# Altium schematic sheet STM32_ nRF24GHz.SchDoc
size 250 x 199 mm; SheetNumber: 2; SheetTotal: 2
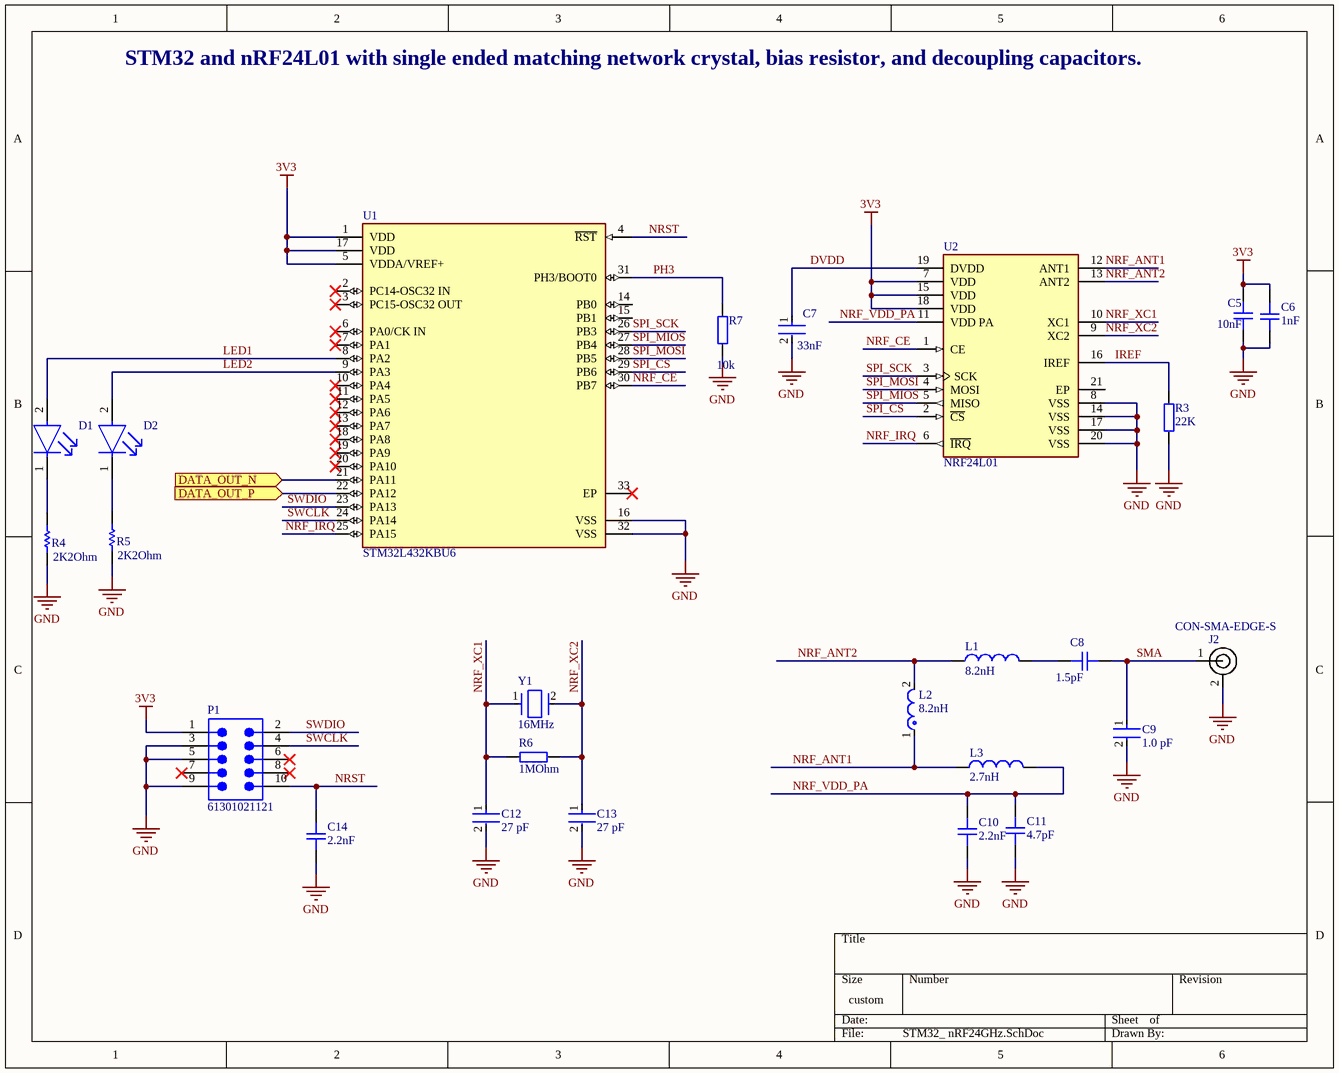
[diagram p0: STM32_ nRF24GHz.SchDoc]

## Parts
C5  Parameter 1: 10nF  [CAP_0402]  (hidden comment: C0402)
C6  Parameter 1: 1nF  [CAP_0402]  (hidden comment: C0402)
C7  value 33nF  [FP-C0402-BB-MFG]  (hidden comment: C0402C333K4RACTU)
C8  Parameter 1: 1.5pF  [CAP_0402]  (hidden comment: C0402)
C9  Capacitance: 1.0 pF  [FP-C0402-BB-MFG]  (hidden comment: C0402C109C5GACTU)
C10  Parameter 1: 2.2nF  [CAP_0402]  (hidden comment: C0402)
C11  Parameter 1: 4.7pF  [CAP_0402]  (hidden comment: C0402)
C12  value 27 pF  [FP-C0402-BB-MFG]  (hidden comment: C0402C270J5GACTU)
C13  value 27 pF  [FP-C0402-BB-MFG]  (hidden comment: C0402C270J5GACTU)
C14  Parameter 1: 2.2nF  [CAP_0402]  (hidden comment: C0402)
D1  LTST-C190GKT  [FP-LTST-C190GKT-MFG]  (value not drawn)
D2  LTST-C190GKT  [FP-LTST-C190GKT-MFG]  (value not drawn)
J2  CON-SMA-EDGE-S  [CON-SMA-EDGE-S]
L1  Inductance: 8.2nH  [WE-TCI_0402]  (hidden comment: 744901082)
L2  Inductance: 8.2nH  [FP-LQG15HH_02-MFG]  (hidden comment: LQG15HN8N2J02D)
L3  Inductance: 2.7nH  [WE-TCI_0402]  (hidden comment: 744901027)
P1  61301021121  [61301021121]
R3  22K  [RES_0402]
R4  Parameter 1: 2K2Ohm  [RESC1005X40X25LL05T05]  (hidden comment: CRCW040242K2FKED)
R5  Parameter 1: 2K2Ohm  [RESC1005X40X25LL05T05]  (hidden comment: CRCW040242K2FKED)
R6  1MOhm  [RES_0402]
R7  10k  [RES_0402]
U1  STM32L432KBU6  [FP-UFQFPN32-A0B8-MFG]
U2  NRF24L01  [FP-NRF24L01-IPC_C]
Y1  Frequency: 16MHz  [FP-ABM3-MFG]  (hidden comment: ABM3-16.000MHZ-D2Y-T)

## Ports
DATA_OUT_N (in, see USB_Power_3V3_Regulator[3D]), DATA_OUT_P (in, see USB_Power_3V3_Regulator[3D])

## Nets
3V3: C5.2 C6.2 P1.1 U1.1(VDD) U1.5(VDDA/VREF+) U1.17(VDD) U2.7(VDD) U2.15(VDD) U2.18(VDD)
GND: C5.1 C6.1 C7.2 C9.2 C10.1 C11.1 C12.2 C13.2 C14.1 J2.2 P1.3 P1.5 P1.9 R3.1 R4.1 R5.1 R7.2 U1.16(VSS) U1.32(VSS) U2.8(VSS) U2.14(VSS) U2.17(VSS) U2.20(VSS)
DATA_OUT_N: U1.21(PA11) ; port DATA_OUT_N
DATA_OUT_P: U1.22(PA12) ; port DATA_OUT_P
DVDD: C7.1 U2.19(DVDD)
IREF: R3.2 U2.16(IREF)
LED1: D1.2(A) U1.8(PA2)
LED2: D2.2(A) U1.9(PA3)
NRF_ANT1: L2.1 L3.1 U2.12(ANT1)
NRF_ANT2: L1.1 L2.2 U2.13(ANT2)
NRF_CE: U1.30(PB7) U2.1(CE)
NRF_IRQ: U1.25(PA15) U2.6(~{IRQ})
NRF_VDD_PA: C10.2 C11.2 L3.2 U2.11(VDD_PA)
NRF_XC1: C12.1 R6.2 U2.10(XC1) Y1.1
NRF_XC2: C13.1 R6.1 U2.9(XC2) Y1.2
NRST: C14.2 P1.10 U1.4(~{RST})
PH3: R7.1 U1.31(PH3/BOOT0)
SMA: C8.2 C9.1 J2.1
SPI_CS: U1.29(PB6) U2.2(~{CS})
SPI_MIOS: U1.27(PB4) U2.5(MISO)
SPI_MOSI: U1.28(PB5) U2.4(MOSI)
SPI_SCK: U1.26(PB3) U2.3(SCK)
SWCLK: P1.4 U1.24(PA14)
SWDIO: P1.2 U1.23(PA13)
NetC8_1: C8.1 L1.2
NetD1_1: D1.1(C) R4.2
NetD2_1: D2.1(C) R5.2

Not connected (* = marked no-connect by the designer): P1 6* 7* 8*; U1 2(PC14-OSC32_IN)* 3(PC15-OSC32_OUT)* 6(PA0/CK_IN)* 7(PA1)* 10(PA4)* 11(PA5)* 12(PA6)* 13(PA7)* 14(PB0) 15(PB1) 18(PA8)* 19(PA9)* 20(PA10)* 33(EP)*; U2 21(EP)

## Notes on the sheet
- STM32 and nRF24L01 with single ended matching network crystal, bias resistor, and decoupling capacitors.

## Library data of the parts
C5 C6 C8 C10 C11 C14 = CAP_0402: Capacitor SMD 0402; Manufacturer: *; Manufacturer Part Number: *; Distributor Link: *; LCSC: *; Rating: *; Dielectric: *
C7 = CMP-2008-03182-2: 0402 C 33nF Ceramic Multilayer Capacitor; 16 V; +125degC; X7R Dielectric; +/-10%; Manufacturer: Kemet; Voltage Rating: 16 V; Temperature Coefficient: 15%; Tolerance: 0.1; Device Class L3: Ceramic Capacitors; Manufacturer Part Number: C0402C333K4RACTU; Mouser Description: 0402 C 33nF Ceramic Multilayer Capacitor; 16 V; +125degC; X7R Dielectric; +/-10%; Temperature: -55°C to +125°C; Height: 0.55mm; RoHS: TRUE; Capacitance: 33nF; Digikey Description: 0402 C 33nF Ceramic Multilayer Capacitor; 16 V; +125degC; X7R Dielectric; +/-10%; Lead Free: Yes; Temperature Range Low: -55°C; Octopart: https://octopart.com/c0402c333k4ractu-kemet-128815; Temperature Characteristic: X7R; Automotive: No; Device Class L1: Passive Components; Device Class L2: Capacitors; ComponentLink2URL: https://content.kemet.com/datasheets/KEM_C1002_X7R_SMD.pdf; Material: Ceramic; Ipc Land Pattern Name: CAPC10050X50; ComponentLink2Description: Datasheet; Category: Cap; Temperature Range High: +125°C; Package: C0402-BB
C9 = CMP-2008-03470-3: CAP CER 1PF 50V NP0 0402; Manufacturer: Kemet; Temperature Characteristic: C0G; Tolerance: 0.25 pF; Temperature Coefficient: 15%; Value: 1.0 pF; Material: Ceramic; Automotive: No; Device Class L1: Passive Components; RoHS: TRUE; Manufacturer Part Number: C0402C109C5GACTU; Device Class L2: Capacitors; Height: 0.55mm; Octopart: https://octopart.com/c0402c109c5gactu-kemet-9138550; Temperature Range Low: -55°C; ComponentLink2URL: https://content.kemet.com/datasheets/KEM_C1002_X7R_SMD.pdf; Temperature Range High: +125°C; ComponentLink2Description: Datasheet; Mouser Description: Multilayer Ceramic Capacitors MLCC - SMD/SMT 50volts 1.0pF C0G .25pF; Digikey Description: CAP CER 1PF 50V NP0 0402; Package: C0402-BB; Temperature: -55°C to +125°C; Ipc Land Pattern Name: CAPC10050X50; Category: Cap; Device Class L3: Ceramic Capacitors; Voltage Rating: 50 V; Lead Free: Yes
C12 C13 = CMP-1034-00963-6: CAP CER 27PF 50V C0G/NP0 0402; Manufacturer: Kemet; Temperature Coefficient: 15%; Tolerance: 0.05; Temperature Characteristic: C0G; Material: Ceramic; Device Class L1: Passive Components; Device Class L3: Ceramic Capacitors; RoHS: TRUE; Height: 0.55mm; Device Class L2: Capacitors; Capacitance: 27 pF; Automotive: No; Octopart: https://octopart.com/c0402c270j5gactu-kemet-149444; Temperature: -55°C to +125°C; Temperature Range Low: -55°C; Package: C0402-BB; Ipc Land Pattern Name: CAPC10050X50; Category: Cap; Lead Free: Yes; Temperature Range High: +125°C; ComponentLink2URL: https://content.kemet.com/datasheets/KEM_C1002_X7R_SMD.pdf; ComponentLink2Description: Datasheet; Manufacturer Part Number: C0402C270J5GACTU; Mouser Description: Multilayer Ceramic Capacitor, C Series, 27 pF, - 5%, C0G / NP0, 50 V, 0402 [1005 Metric]; Digikey Description: CAP CER 27PF 50V C0G/NP0 0402; Voltage Rating: 50 V
D1 D2 = CMP-22017-000005-2: LED GREEN CLEAR CHIP SMD; Dominant Wavelength: 569nm; Reverse Voltage: 5V; Lens Color: Colorless; Viewing Angle: 130°; Voltage: 2V; Forward Current: 30mA; Power Dissipation: 100mW; Luminous Intensity: 6mcd; Number of LEDs: 1; Forward Voltage: 2.1V; Wavelength: 565nm; Test Current: 10mA; Min Operating Temperature: -55°C; Lens Style: Clear; Mount: Surface Mount; Width: 0.8mm; Packaging: Tape and Reel; Lens Transparency: Clear; Case Code (Metric): 1608; Depth: 0.8mm; Case Code (Imperial): 0603; Case/Package: 0603; Number of Pins: 2; Max Operating Temperature: 85°C; Lead Free: Lead Free; Number of Elements: 1; Length: 1.6mm; Height: 0.8mm; Package Quantity: 1; Power Rating: 100mW; Radiation Hardening: No; Illumination Color: Green; Color: Green
J2 = CON-SMA-EDGE-S: RF Connector SMA Female 50 Ohms 18 GHz PCB Edge Mount; Manufacturer: RF Solutions; Manufacturer Part Number: CON-SMA-EDGE-S
L1 = CMP-03913-14415882-1: 744901082 Fixed Ind 8.2NH 220MA 1.1 Ohm SMD; Test Frequency: 500MHz; DC Resistance (DCR): 540mΩ; Tolerance: 2%; Q Factor: 13; Self Resonant Frequency: 5.5GHz; Shielding: Unshielded; Height: 320µm; Width: 500µm; Termination: SMD/SMT; Height - Seated (Max): 406.4µm; Min Operating Temperature: -40°C; Packaging: Digi-Reel®; REACH SVHC: Unknown; NexarPartId: 14415882; Case Code (Metric): 1005; Current Rating: 220mA; Number of Pins: 2; Weight: 652.039032µg; Max Operating Temperature: 125°C; Mount: Surface Mount; Case Code (Imperial): 0402; Case/Package: 0402; RoHS: Compliant; Composition: Thin Film; Max DC Current: 220mA; Length: 1mm
L2 = CMP-06042-008586-1: Multilayer type RF Inductor 8.2nH ±5% 0.25Ω 500mA 0402; Core Material: Air; Shielding: Unshielded; Current Rating: 300mA; Test Frequency: 100MHz; Self Resonant Frequency: 3.6GHz; Q Factor: 8; DC Resistance (DCR): 330mR; Case/Package: 0402; Max Operating Temperature: 125°C; Military Standard: Not; Depth: 0.55mm; Lead Free: Lead Free; DC Current: 300mA; Length: 1mm; Height: 0.02inch; Width: 0.5mm; Termination: SMD/SMT; Max DC Current: 300mA; Min Operating Temperature: -55°C; Height - Seated (Max): 0.022inch; Radiation Hardening: No; Packaging: Tape and Reel; REACH SVHC: No SVHC; Case Code (Imperial): 0402; Package Quantity: 1; Tolerance: 5%; Case Code (Metric): 1005; Mount: Surface Mount; Inductance Tolerance: 5%
L3 = CMP-03913-14415876-1: 744901027 Fixed Ind 2.7NH 440MA 300MOHM Sm; Test Frequency: 500MHz; Core Material: Alumina; Self Resonant Frequency: 8GHz; DC Resistance (DCR): 270mΩ; Shielding: Unshielded; Q Factor: 13; Length: 1mm; NexarPartId: 14415876; Case/Package: 0402; Min Operating Temperature: -40°C; Number of Pins: 2; Packaging: Tape & Reel (TR); RoHS: Compliant; Termination: SMD/SMT; Current Rating: 440mA; Width: 500µm; Max DC Current: 440mA; Case Code (Metric): 1005; Mount: Surface Mount; Case Code (Imperial): 0402; Height: 320µm; REACH SVHC: Unknown; Height - Seated (Max): 406.4µm; Composition: Thin Film; Max Operating Temperature: 125°C; Weight: 652.039032µg
P1 = CMP-1502-01084-3: NexarPartId: 18818163; Connector Type: Male Pin; Insulation Resistance: 1GΩ; Row Spacing: 2.54mm; Insulation: Insulated; Number of Positions: 10; Current Rating: 3A; Voltage Rating: 250V; Gender: Male; Contact Resistance: 20mΩ; Contact Gender: Male; Number of Rows: 2; Min Operating Temperature: -40°C; Mount: Through Hole; Packaging: Bulk; Length: 12.7mm; Pitch: 2.54mm; RoHS: Compliant; Height: 2.54mm; Lead Pitch: 2.54mm; Number of Pins: 10; Housing Material: PBT; Orientation: Vertical; Flammability Rating: UL94 V-0; Termination: Through Hole; Width: 12.7mm; Color: Black; Contact Mating Length: 5.9944mm; Max Operating Temperature: 105°C; Operating Supply Voltage: 250V; Contact Material: Copper; Number of Contacts: 10; Contact Plating: Gold; REACH SVHC: Unknown
R3 R6 R7 = RES_0402: Resistor SMD 0402; Manufacturer: *; Manufacturer Part Number: *; Distributor Link: *; LCSC: *
  R7: Resistance: 10k
R4 R5 = CMP-2002-08626-1: Manufacturer: Vishay Dale; Part Number: CRCW040242K2FKED
U1 = CMP-12105-000014-1: IC MCU 32BIT 128KB FLASH 32QFPN; Manufacturer: STMicroelectronics; Memory Size: 128KBytes; Number Of I/Os: 26; Max Supply Voltage: 3.6V; Core Architecture: ARM Cortex-M4; Number Of A/D Converters: 1; Number Of Timers/Counters: 8; Min Supply Voltage: 1.62V; Interface: I2C,SPI,UART,USART,USB,IrDA; Number Of Spi Channels: 2; Frequency: 80MHz; Max Junction Temp: +105°C; Number Of Adc Channels: 10; Ram Size: 64KBytes; Data Bus Width: 32bits; Ambient Temperature Range High: +85°C; Device Class L2: Embedded Processors and Controllers; Temperature: -40°C to +85°C; Category: IC; ComponentLink2URL: https://www.st.com/resource/en/datasheet/stm32l432kb.pdf; Device Class L1: Integrated Circuits (ICs); ComponentLink2Description: Datasheet; Memory Type: FLASH; Ipc Land Pattern Name: QFN50P500X500X55-32; Temperature Range Low: -40°C; Height: 0.6mm; Digikey Description: IC MCU 32BIT 128KB FLASH 32QFPN; Temperature Range High: +85°C; Device Class L3: Microcontrollers; Lead Free: Yes; RoHS: TRUE; Octopart: https://octopart.com/stm32l432kbu6-stmicroelectronics-74568735; Manufacturer Part Number: STM32L432KBU6; Number Of Uart Channels: 1; Ambient Temperature Range Low: -40°C; Package: UFQFPN32-A0B8; Number Of I2C Channels: 2; Number Of Cores: 1; Automotive: No
U2 = CMP-228436-000003-1: IC RF TXRX ISM>1GHZ 20VFQFN
Y1 = CMP-27762-004490-1: Crystal 16MHz ±20ppm 18pF SMD-2 5mm x 3.2mm; Frequency Stability: 30ppm; Series Resistance: 40R; Tolerance: 20ppm; Frequency Tolerance: 20ppm; Load Capacitance: 18pF; Resistor Type: Ceramic; Termination: SMD/SMT; Width: 0.126inch; Mount: Surface Mount; RoHS Compliant: Yes; Package Quantity: 1000; Height: 0.051inch; Length: 0.197inch; Operating Frequency: 16 MHz; Packaging: Tape and Reel; Max Operating Temperature: 85°C; Series: ABM3; Case/Package: SMD/SMT; Lead Free: Lead Free; ESR (Equivalent Series Resistance): 40R; Number of Pins: 2; Min Operating Temperature: -40°C